# Altium project HSP-Arduino-Shield.PrjPcb
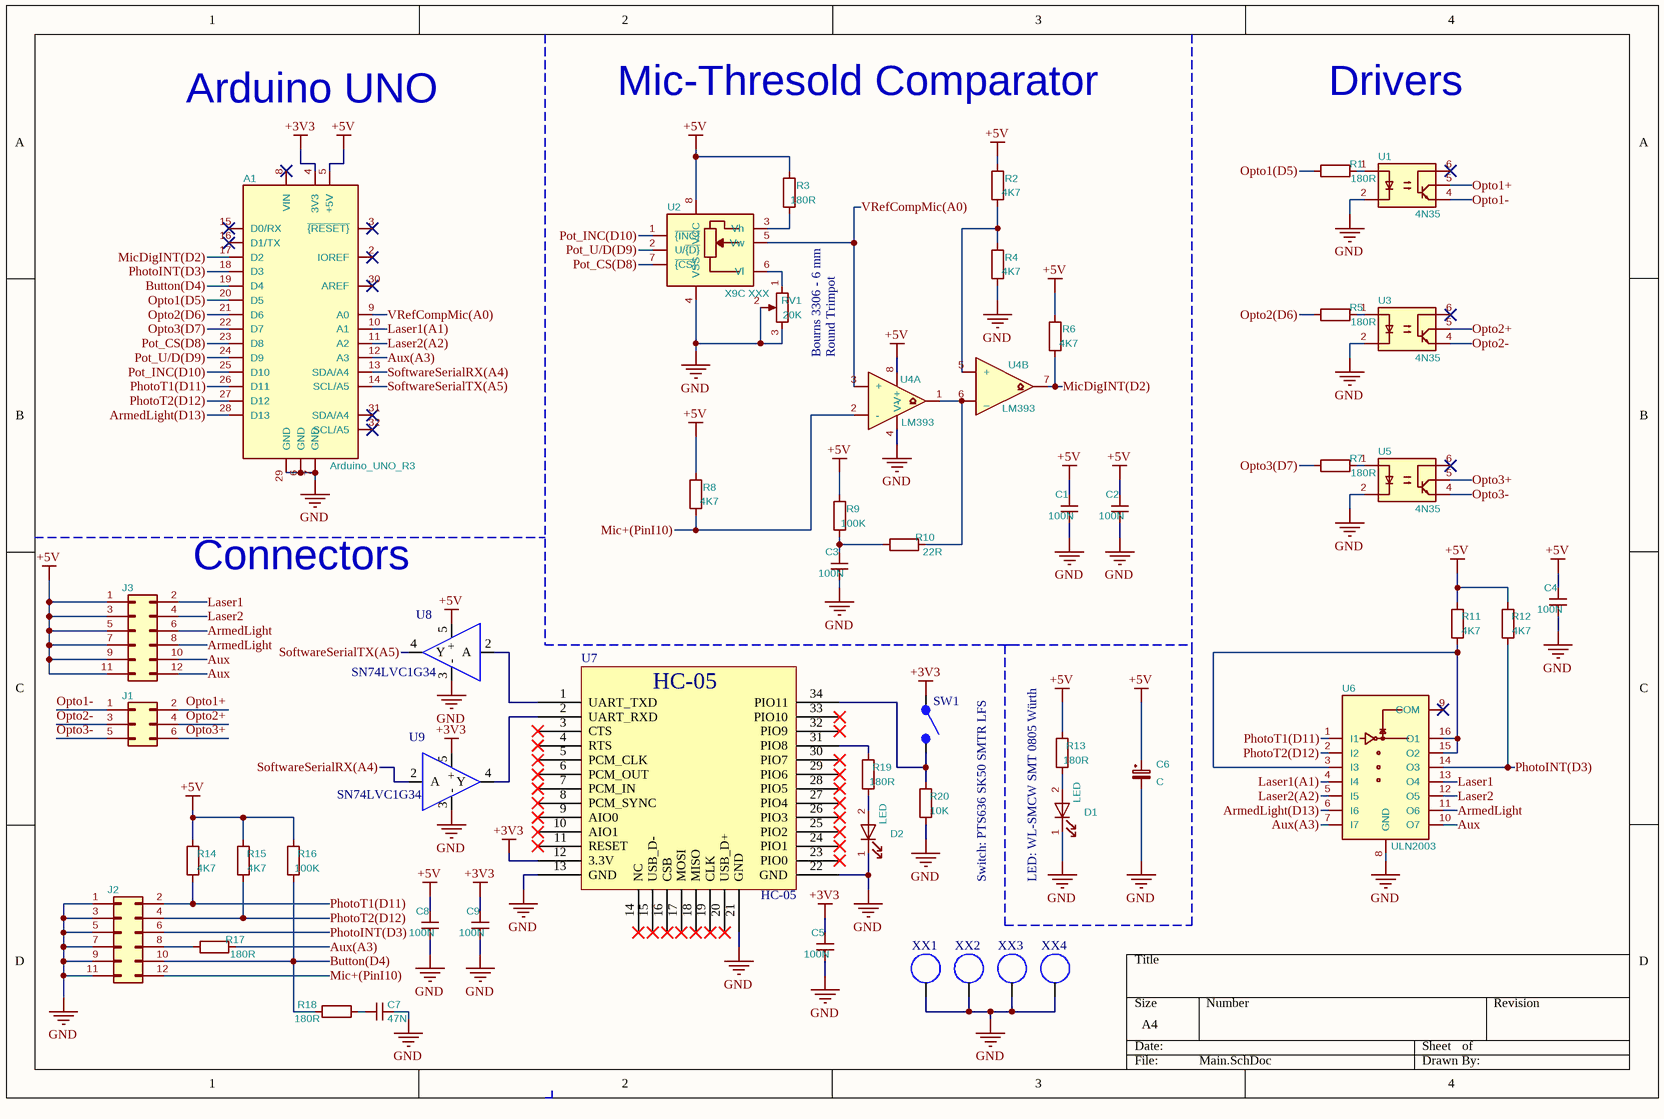
[diagram p0: Main.SchDoc]
1 sheet, 50 parts. Net scope: global (net labels, ports and power ports of the same name join across sheets).
Board file: HSP-Arduino-Shield.PcbDoc

## Sheet Main.SchDoc
size A4; SheetNumber: 1; SheetTotal: 1

### Parts
A1  Arduino_UNO_R3  [ARDUINO_UNO_SHIELD]
C1  100N  [C_0805_WAVESOLDER]
C2  100N  [C_0805_WAVESOLDER]
C3  100N  [C_0805_WAVESOLDER]
C4  100N  [C_0805_WAVESOLDER]
C5  100N  [C_0805_WAVESOLDER]
C6  C  [CAPAE7466X55M]
C7  47N  [C_0805_WAVESOLDER]
C8  100N  [C_0805_WAVESOLDER]
C9  100N  [C_0805_WAVESOLDER]
D1  LED  [Wurth_WL-SMCW_0805_LED]
D2  LED  [Wurth_WL-SMCW_0805_LED]
J1  OptocoupledOutputs  [PIN_HEADER_3X2]  (value not drawn)
J2  Open Collector Outputs  [PIN_HEADER_6X2]  (value not drawn)
J3  Open Collector Outputs  [PIN_HEADER_6X2]  (value not drawn)
R1  180R  [R_0805_WAVESOLDER]
R2  4K7  [R_0805_WAVESOLDER]
R3  180R  [R_0805_WAVESOLDER]
R4  4K7  [R_0805_WAVESOLDER]
R5  180R  [R_0805_WAVESOLDER]
R6  4K7  [R_0805_WAVESOLDER]
R7  180R  [R_0805_WAVESOLDER]
R8  4K7  [R_0805_WAVESOLDER]
R9  100K  [R_0805_WAVESOLDER]
R10  22R  [R_0805_WAVESOLDER]
R11  4K7  [R_0805_WAVESOLDER]
R12  4K7  [R_0805_WAVESOLDER]
R13  180R  [R_0805_WAVESOLDER]
R14  4K7  [R_0805_WAVESOLDER]
R15  4K7  [R_0805_WAVESOLDER]
R16  100K  [R_0805_WAVESOLDER]
R17  180R  [R_0805_WAVESOLDER]
R18  180R  [R_0805_WAVESOLDER]
R19  180R  [R_0805_WAVESOLDER]
R20  10K  [R_0805_WAVESOLDER]
RV1  20K  [Bourns_3306-6mm_Trimpot]
SW1  PTS636SK50SMTRLFS  [PTS636SK50SMTRLFS]  (value not drawn)
U1  4N35  [4N35_SMD-6]
U2  X9C XXX  [X9C_XXX_SOIC8]
U3  4N35  [4N35_SMD-6]
U4  LM393  [LM393M]  (parts A,B of 2)
U5  4N35  [4N35_SMD-6]
U6  ULN2003  [ULN2003]
U7  HC-05  [HC-05]
U8  SN74LVC1G34  [SN74LVC1G34]
U9  SN74LVC1G34  [SN74LVC1G34]
XX1  3.2MM_HOLE  [3.2MM_HOLE]  (value not drawn)
XX2  3.2MM_HOLE  [3.2MM_HOLE]  (value not drawn)
XX3  3.2MM_HOLE  [3.2MM_HOLE]  (value not drawn)
XX4  3.2MM_HOLE  [3.2MM_HOLE]  (value not drawn)

### Nets
+3V3: A1.4(3V3) C5.2 C9.2 SW1.1 U7.12(3.3V) U9.5(+)
+5V: A1.5(+5V) C1.2 C2.2 C4.2 C6.1 C8.2 J3.1(Pin_1) J3.3(Pin_3) J3.5(Pin_5) J3.7(Pin_7) J3.9(Pin_9) J3.11(Pin_11) R2.1 R3.1 R6.1 R8.1 R9.1 R11.1 R12.1 R13.1 R14.1 R15.1 R16.1 U2.8(VCC) U4.8(V+) U8.5(+)
GND: A1.6(GND) A1.7(GND) A1.29(GND) C1.1 C2.1 C3.1 C4.1 C5.1 C6.2 C7.2 C8.1 C9.1 D1.1(K) D2.1(K) J2.1(Pin_1) J2.3(Pin_3) J2.5(Pin_5) J2.7(Pin_7) J2.9(Pin_9) J2.11(Pin_11) R4.2 R20.2 RV1.2 RV1.3 U1.2 U2.4(VSS) U3.2 U4.4(V-) U5.2 U6.8(GND) U7.13(GND) U7.21(GND) U7.22(GND) U8.3(-) U9.3(-) XX1.1 XX2.1 XX3.1 XX4.1
ArmedLight: J3.6(Pin_6) J3.8(Pin_8) U6.11(O6)
ArmedLight(D13): A1.28(D13) U6.6(I6)
Aux: J3.10(Pin_10) J3.12(Pin_12) U6.10(O7)
Aux(A3): A1.12(A3) R17.2 U6.7(I7)
Button(D4): A1.19(D4) J2.10(Pin_10) R16.2 R18.1
Laser1: J3.2(Pin_2) U6.13(O4)
Laser1(A1): A1.10(A1) U6.4(I4)
Laser2: J3.4(Pin_4) U6.12(O5)
Laser2(A2): A1.11(A2) U6.5(I5)
Mic+(PinI10): J2.12(Pin_12) R8.2 U4.2(-)
MicDigINT(D2): A1.17(D2) R6.2 U4.7
Opto1(D5): A1.20(D5) R1.1
Opto1+: J1.2(Pin_2) U1.5
Opto1-: J1.1(Pin_1) U1.4
Opto2(D6): A1.21(D6) R5.1
Opto2+: J1.4(Pin_4) U3.5
Opto2-: J1.3(Pin_3) U3.4
Opto3(D7): A1.22(D7) R7.1
Opto3+: J1.6(Pin_6) U5.5
Opto3-: J1.5(Pin_5) U5.4
PhotoINT(D3): A1.18(D3) J2.6(Pin_6) R12.2 U6.14(O3)
PhotoT1(D11): A1.26(D11) J2.2(Pin_2) R14.2 U6.1(I1)
PhotoT2(D12): A1.27(D12) J2.4(Pin_4) R15.2 U6.2(I2)
Pot_CS(D8): A1.23(D8) U2.7(~{{CS}})
Pot_INC(D10): A1.25(D10) U2.1(~{{INC}})
Pot_U/D(D9): A1.24(D9) U2.2(U/~{{D}})
SoftwareSerialRX(A4): A1.13(SDA/A4) U9.2(A)
SoftwareSerialTX(A5): A1.14(SCL/A5) U8.4(Y)
VRefCompMic(A0): A1.9(A0) U2.5(Vw) U4.3(+)
NetC3_2: C3.2 R9.2 R10.1
NetC7_1: C7.1 R18.2
NetD1_2: D1.2(A) R13.2
NetD2_2: D2.2(A) R19.2
NetJ2_8: J2.8(Pin_8) R17.1
NetR1_2: R1.2 U1.1
NetR2_2: R2.2 R4.1 U4.5(+)
NetR3_2: R3.2 U2.3(Vh)
NetR5_2: R5.2 U3.1
NetR7_2: R7.2 U5.1
NetR10_2: R10.2 U4.1 U4.6(_)
NetR11_2: R11.2 U6.3(I3) U6.15(O2) U6.16(O1)
NetR19_1: R19.1 U7.31(PIO8)
NetR20_1: R20.1 SW1.2 U7.34(PIO11)
NetRV1_1: RV1.1 U2.6(Vl)
NetU7_1: U7.1(UART_TXD) U8.2(A)
NetU7_2: U7.2(UART_RXD) U9.4(Y)

Not connected (* = marked no-connect by the designer): A1 1(NC) 2(IOREF)* 3(~{{RESET}})* 8(VIN)* 15(D0/RX)* 16(D1/TX)* 30(AREF)* 31(SDA/A4)* 32(SCL/A5)*; U1 3(NC) 6*; U3 3(NC) 6*; U5 3(NC) 6*; U6 9(COM)*; U7 3(CTS)* 4(RTS)* 5(PCM_CLK)* 6(PCM_OUT)* 7(PCM_IN)* 8(PCM_SYNC)* 9(AIO0)* 10(AIO1)* 11(RESET)* 14(NC)* 15(USB_D-)* 16(CSB)* 17(MOSI)* 18(MISO)* 19(CLK)* 20(USB_D+)* 23(PIO0)* 24(PIO1)* 25(PIO2)* 26(PIO3)* 27(PIO4)* 28(PIO5)* 29(PIO6)* 30(PIO7)* 32(PIO9)* 33(PIO10)*

### Notes on the sheet
- Arduino UNO
- Mic-Thresold Comparator
- Drivers
- Bourns 3306 - 6 mm
- Round Trimpot
- Connectors
- Switch: PTS636 SK50 SMTR LFS
- LED: WL-SMCW SMT 0805 Würth

### Library data of the parts
C1-C5 C7-C9 = C_NP: Footprint: C_NP_0805
  C1-C5 C8 C9: Value: 100N
  C7: Value: 47N
C6 = C_POL: Footprint: Capacitor_SMD:CP_Elec_6.3x5.4; Value: C
J1 = Conn_02x03_Odd_Even: Footprint: Connector_PinHeader_2.54mm:PinHeader_2x03_P2.54mm_Vertical_SMD
J2 J3 = Conn_02x06_Odd_Even: Footprint: Connector_PinHeader_2.54mm:PinHeader_2x06_P2.54mm_Vertical_SMD
R1-R20 = R: Footprint: R_0805
  R1 R3 R5 R7 R13 R17-R19: Value: 180R
  R2 R4 R6 R8 R11 R12 R14 R15: Value: 4K7
  R9 R16: Value: 100K
  R10: Value: 22R
  R20: Value: 10K
RV1 = R_Potentiometer: Footprint: Potentiometer_SMD:Potentiometer_Bourns_3314J_Vertical; Value: 20K
A1 = Arduino_UNO_R3: Footprint: Module:Arduino_UNO_R3; Value: Arduino_UNO_R3
D1 D2 = LED: Footprint: LED_SMD:LED_0603_1608Metric_Pad1.05x0.95mm_HandSolder; Value: LED
SW1 = PTS636SK50SMTRLFS: Supplier 1: Digi-Key; Supplier Part Number 1: CKN12315-1-ND
U1 U3 U5 = 4N35: Footprint: Package_DIP:DIP-6_W8.89mm_SMDSocket_LongPads; Value: 4N35
U2 = X9C XXX: Footprint: Package_SO:SSOP-8_3.9x5.05mm_P1.27mm; Value: X9C XXX
U4 = LM393: Footprint: Package_SO:SOIC-8-1EP_3.9x4.9mm_P1.27mm_EP2.29x3mm; Value: LM393
U6 = ULN2003: Footprint: Package_SO:SOIC-16_3.9x9.9mm_P1.27mm; Value: ULN2003